# EAGLE board EEZ Arduino shield r1B12b (EAGLE 6.1), part 1 of 2
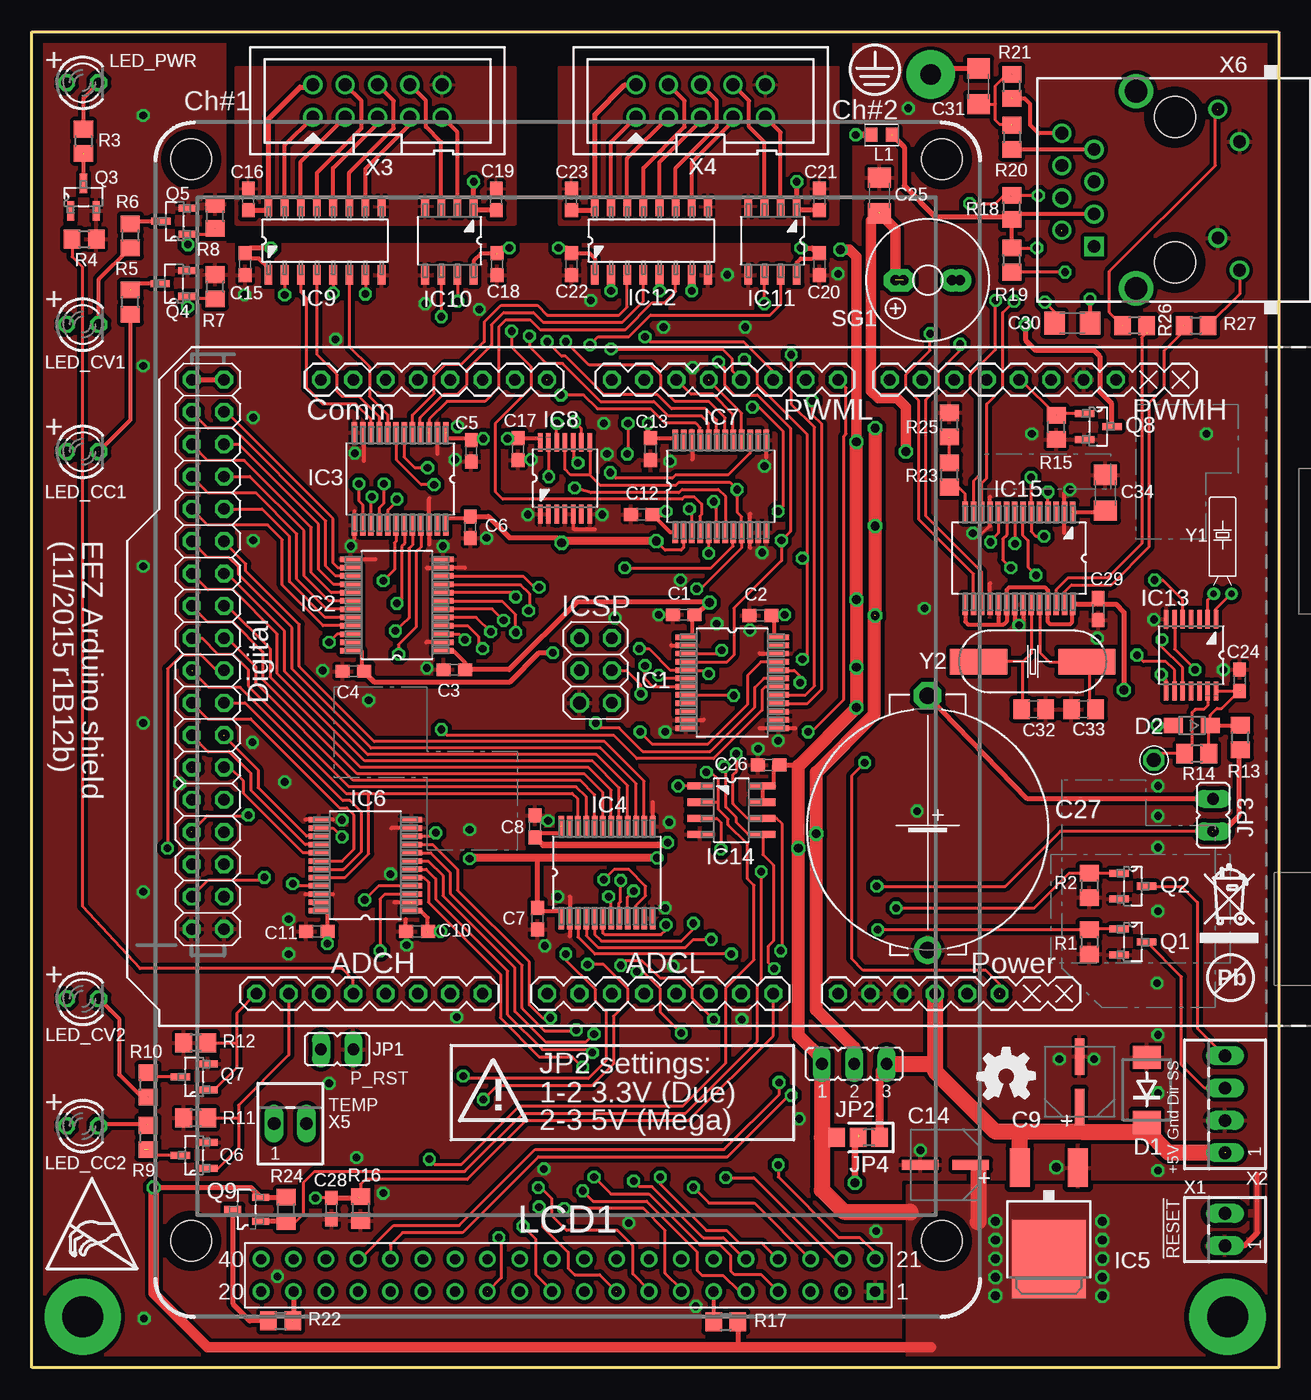
[diagram p3: board, top side]
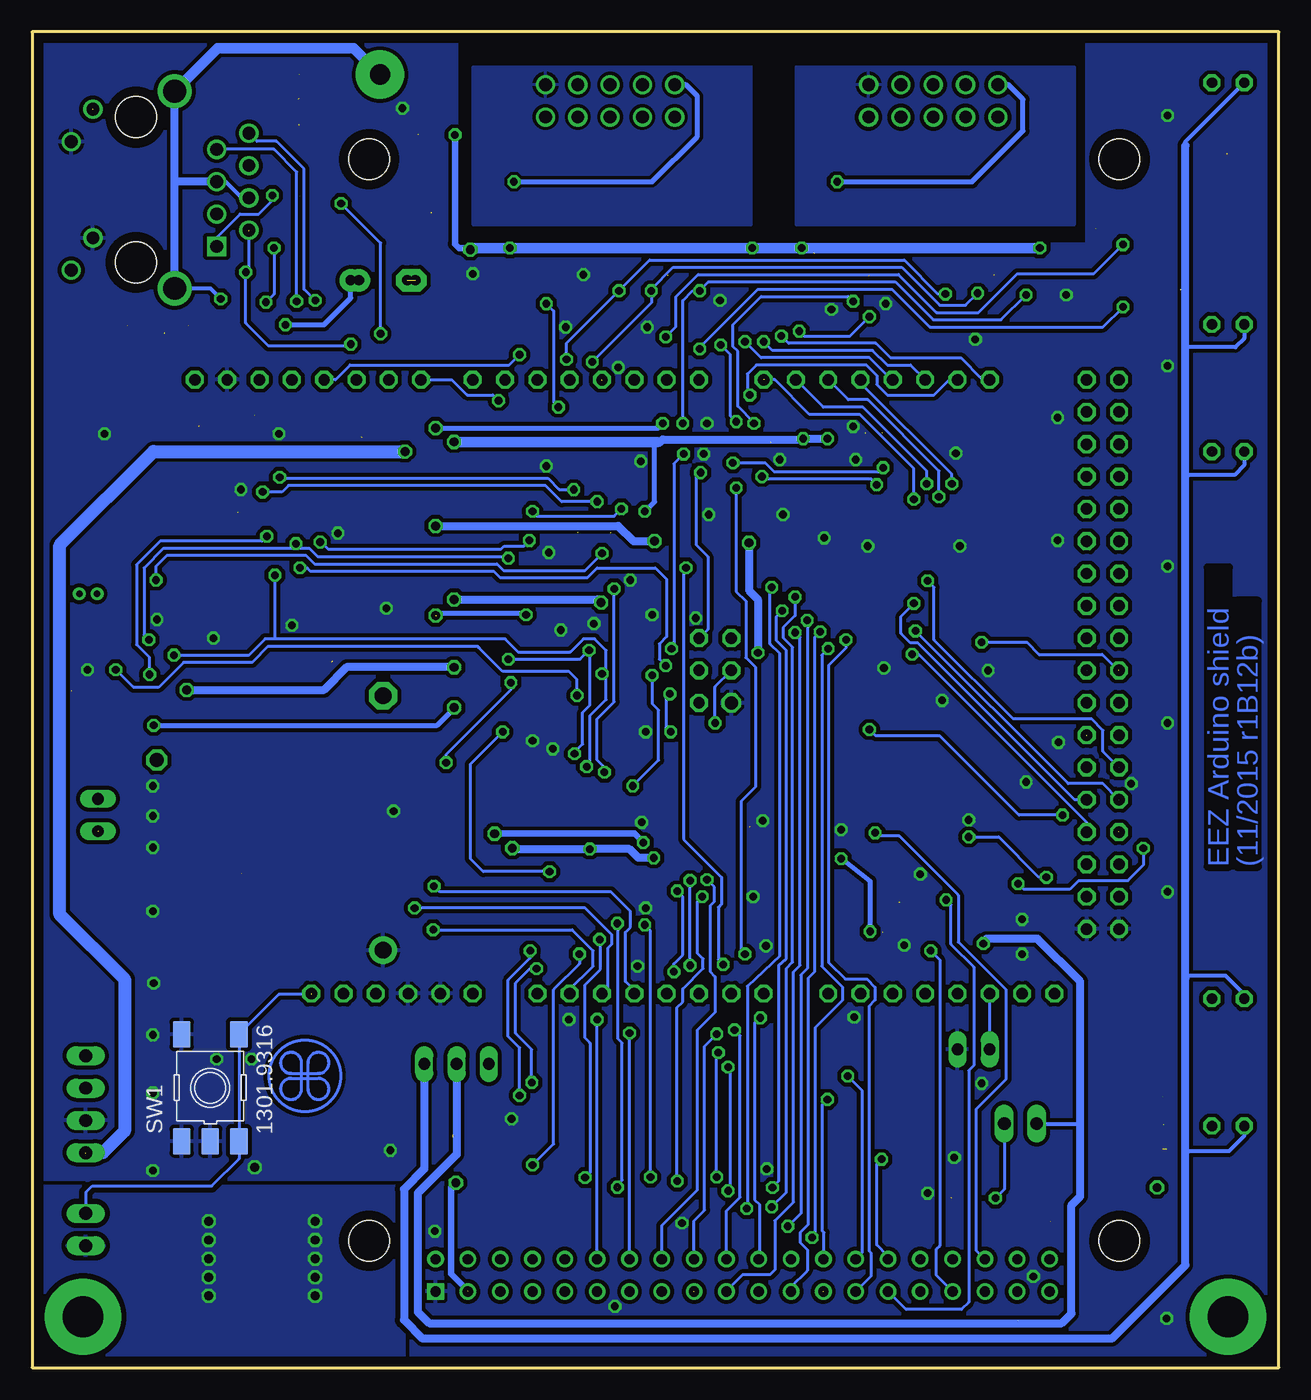
[diagram p4: board, bottom side, seen from below]

Size 98.03 x 105 mm. Coordinates in mm from the lower left corner, seen from the top.
Outline: 0,0 0,105 98,105 98,0 0,0
Copper layers (1+5*16): Top 0.035mm / dielectric 0.75mm / Route5 0.035mm / dielectric 0.75mm / Bottom 0.035mm
Design rules: minimum track width 10mil, minimum drill 0.5mm, track to track 8mil, track to pad 8mil, pad to pad 8mil, via to via 8mil, smd to smd 8mil, copper to edge 30mil, drill to drill 8mil, minimum pad ring 10mil, minimum via ring 8mil, stop-mask expansion 0mil, vias tented up to drill 25mil, thermal gap 10mil
Net classes: 0 default: width 0.254 mm, drill 0.61 mm, clearance 0.254 mm; 1 power: width 0.254 mm, drill 0.406 mm, clearance 0.203 mm; 2 gnd: width 0.254 mm, drill 0.406 mm, clearance 0.203 mm; 3 isolators: width 0.254 mm, drill 0.61 mm, clearance 0.254 mm

## Footprints (pad centres in the part's own frame; a part is rotated, then mirrored left to right if it is on the bottom)
C0603 = smd 1.1 x 1: 1 -0.85,0; 2 0.85,0
PANASONIC_C = smd 2.87 x 0.762: 1 -1.981,0; 2 1.981,0
C1206 = smd 1.6 x 1.8: 1 -1.4,0; 2 1.4,0
SG-R20MM = drill 1.3 pad 2.184 octagon: 1 10.389,0 | drill 1.3 pad 2.184: 2 -9.601,0
C0805 = smd 1.3 x 1.5: 1 -0.95,0; 2 0.95,0
DO214AA = smd 1.8 x 2.2: A 2.55,0; C -2.55,0
SOD323-W = smd 1.5 x 1.2: A 1.45,0; C -1.45,0
SOP65P780X200-24N = smd 1.651 x 0.432: 1 -3.632,3.581; 2 -3.632,2.921; 3 -3.632,2.286; 4 -3.632,1.626; 5 -3.632,0.965; 6 -3.632,0.33; 7 -3.632,-0.33; 8 -3.632,-0.965; 9 -3.632,-1.626; 10 -3.632,-2.286; 11 -3.632,-2.921; 12 -3.632,-3.581; 13 3.632,-3.581; 14 3.632,-2.921; 15 3.632,-2.286; 16 3.632,-1.626; 17 3.632,-0.965; 18 3.632,-0.33; 19 3.632,0.33; 20 3.632,0.965; 21 3.632,1.626; 22 3.632,2.286; 23 3.632,2.921; 24 3.632,3.581
DPACK = smd 1.6 x 3: 1 -2.28,-4.8; 3 2.28,-4.8 | smd 5.8 x 6.2: 4 0,2.38
SOP65P640X120-14N = smd 1.473 x 0.356: 1 -2.819,1.956; 2 -2.819,1.295; 3 -2.819,0.66; 4 -2.819,0; 5 -2.819,-0.66; 6 -2.819,-1.295; 7 -2.819,-1.956; 8 2.819,-1.956; 9 2.819,-1.295; 10 2.819,-0.66; 11 2.819,0; 12 2.819,0.66; 13 2.819,1.295; 14 2.819,1.956
SOIC-16 = smd 1.549 x 0.61: 1 -2.692,4.445; 2 -2.692,3.175; 3 -2.692,1.905; 4 -2.692,0.635; 5 -2.692,-0.635; 6 -2.692,-1.905; 7 -2.692,-3.175; 8 -2.692,-4.445; 9 2.692,-4.445; 10 2.692,-3.175; 11 2.692,-1.905; 12 2.692,-0.635; 13 2.692,0.635; 14 2.692,1.905; 15 2.692,3.175; 16 2.692,4.445
SOIC127P600X173-8N = smd 1.55 x 0.6: 1 -2.7,1.9; 2 -2.7,0.63; 3 -2.7,-0.64; 4 -2.7,-1.91; 5 2.7,-1.91; 6 2.7,-0.64; 7 2.7,0.63; 8 2.7,1.9
SOIC127P600X175-8N = smd 1.981 x 0.559: 1 -2.464,1.905; 2 -2.464,0.635; 3 -2.464,-0.635; 4 -2.464,-1.905; 5 2.464,-1.905; 6 2.464,-0.635; 7 2.464,0.635; 8 2.464,1.905
SOP65P780X200-28N = smd 1.651 x 0.432: 1 -3.632,4.216; 2 -3.632,3.581; 3 -3.632,2.921; 4 -3.632,2.286; 5 -3.632,1.626; 6 -3.632,0.965; 7 -3.632,0.33; 8 -3.632,-0.33; 9 -3.632,-0.965; 10 -3.632,-1.626; 11 -3.632,-2.286; 12 -3.632,-2.921; 13 -3.632,-3.581; 14 -3.632,-4.216; 15 3.632,-4.216; 16 3.632,-3.581; 17 3.632,-2.921; 18 3.632,-2.286; 19 3.632,-1.626; 20 3.632,-0.965; 21 3.632,-0.33; 22 3.632,0.33; 23 3.632,0.965; 24 3.632,1.626; 25 3.632,2.286; 26 3.632,2.921; 27 3.632,3.581; 28 3.632,4.216
JP1 = drill 0.914 long: 1 0,-1.27; 2 0,1.27
JUMPER_3-PIN = drill 0.914 long: 1 -2.54,0; 2 0,0; 3 2.54,0
A0R-JMP = smd 1.5 x 1.3: 1 0,1.7; 2 0,0; 3 0,-1.7
BEAD0603 = smd 1 x 1.1: P$1 -0.85,0; P$2 0.85,0
LCD_TFT_320QVT_MIRROR = drill 0.8 square: 1 48.26,0 | drill 0.8: 2 45.72,0; 3 43.18,0; 4 40.64,0; 5 38.1,0; 6 35.56,0; 7 33.02,0; 8 30.48,0; 9 27.94,0; 10 25.4,0; 11 22.86,0; 12 20.32,0; 13 17.78,0; 14 15.24,0; 15 12.7,0; 16 10.16,0; 17 7.62,0; 18 5.08,0; 19 2.54,0; 20 0,0; 21 48.26,2.54; 22 45.72,2.54; 23 43.18,2.54; 24 40.64,2.54; 25 38.1,2.54; 26 35.56,2.54; 27 33.02,2.54; 28 30.48,2.54; 29 27.94,2.54; 30 25.4,2.54; 31 22.86,2.54; 32 20.32,2.54; 33 17.78,2.54; 34 15.24,2.54; 35 12.7,2.54; 36 10.16,2.54; 37 7.62,2.54; 38 5.08,2.54; 39 2.54,2.54; 40 0,2.54 | hole 3.2: -5.5,4; 53.5,4; -5.5,89; 53.5,89
LED3MM = drill 0.813 octagon: A -1.27,0; K 1.27,0
ARDUINO+ICSP_MIRROR = drill 0.9 octagon: 0 63.5,2.54; 1 60.96,2.54; 2 58.42,2.54; 3 55.88,2.54; 3.3V 35.56,50.8; 4 53.34,2.54; 5 50.8,2.54; 5V 38.1,50.8; 5V(1) 93.98,2.54; 5V(2) 96.52,2.54; 6 48.26,2.54; 7 45.72,2.54; 8 41.656,2.54; 9 39.116,2.54; 10 36.576,2.54; 11 34.036,2.54; 12 31.496,2.54; 13 28.956,2.54; 14 68.58,2.54; 15 71.12,2.54; 16 73.66,2.54; 17 76.2,2.54; 18 78.74,2.54; 19 81.28,2.54; 20 83.82,2.54; 21 86.36,2.54; 22 93.98,5.08; 23 96.52,5.08; 24 93.98,7.62; 25 96.52,7.62; 26 93.98,10.16; 27 96.52,10.16; 28 93.98,12.7; 29 96.52,12.7; 30 93.98,15.24; 31 96.52,15.24; 32 93.98,17.78; 33 96.52,17.78; 34 93.98,20.32; 35 96.52,20.32; 36 93.98,22.86; 37 96.52,22.86; 38 93.98,25.4; 39 96.52,25.4; 40 93.98,27.94; 41 96.52,27.94; 42 93.98,30.48; 43 96.52,30.48; 44 93.98,33.02; 45 96.52,33.02; 46 93.98,35.56; 47 96.52,35.56; 48 93.98,38.1; 49 96.52,38.1; 50 93.98,40.64; 51 96.52,40.64; 52 93.98,43.18; 53 96.52,43.18; A0 50.8,50.8; A1 53.34,50.8; A2 55.88,50.8; A3 58.42,50.8; A4 60.96,50.8; A5 63.5,50.8; A6 66.04,50.8; A7 68.58,50.8; A8 73.66,50.8; A9 76.2,50.8; A10 78.74,50.8; A11 81.28,50.8; A12 83.82,50.8; A13 86.36,50.8; A14 88.9,50.8; A15 91.44,50.8; AREF 23.876,2.54; GND 26.416,2.54; GND1 40.64,50.8; GND2 43.18,50.8; GND3 93.98,45.72; GND4 96.52,45.72; ICSP_+5V 66.04,22.86; ICSP_MISO 63.5,22.86; ICSP_MOSI 66.04,25.4; ICSP_RESET 63.5,27.94; ICSP_SCK 63.5,25.4; RESET 33.02,50.8; VIN 45.72,50.8 | drill 1.016 octagon: ICSP_GND 66.04,27.94
SOT103P240X110-3N = smd 1.524 x 0.559: 1 -1.079,1.016; 2 -1.079,-1.016; 3 1.079,0
SOT95P237X112-3N = smd 1.321 x 0.559: 1 -1.092,0.94; 2 -1.092,-0.94; 3 1.092,0
R0805 = smd 1.3 x 1.5: 1 -0.95,0; 2 0.95,0
BUZZER = drill 0.8 pad 1.778 octagon: + 1.905,0; +B 2.54,0 | drill 0.8 pad 1.778: - -1.905,0; -B -2.54,0
TACTM-6XN = smd 2.1 x 1.4: 1 -4.2,2.25; 2 4.2,2.25; 3 -4.2,-2.25; 4 4.2,-2.25; 5 -4.2,0
PCB_SHIELD_TAB = drill 1.1 octagon: 1 0,0
22-23-2021 = drill 1 long: 1 -1.27,0; 2 1.27,0
22-23-2041 = drill 1 long: 1 -3.81,0; 2 -1.27,0; 3 1.27,0; 4 3.81,0
IDC-10PIN = drill 1 pad 1.422: 1 -5.08,-1.27; 2 -5.08,1.27; 3 -2.54,-1.27; 4 -2.54,1.27; 5 0,-1.27; 6 0,1.27; 7 2.54,-1.27; 8 2.54,1.27; 9 5.08,-1.27; 10 5.08,1.27
RJ45-TRAFO-LED = drill 1 square: 1 -4.445,6.35 | drill 1: 2 -3.175,8.89; 3 -1.905,6.35; 4 -0.635,8.89; 5 0.635,6.35; 6 1.905,8.89; 7 3.175,6.35; 8 4.445,8.89; 9 -6.325,-5.08; 10 -3.785,-3.38; 11 3.785,-5.08; 12 6.325,-3.38 | drill 1.8: SH1 -7.75,3.05; SH2 7.75,3.05 | hole 3.251: -5.715,0; 5.715,0
R26_XTAL = drill 0.5: 1 -0.7,0; 2 0.7,0
HC-49/4H = smd 4.5 x 2: 1 -4.25,0; 2 4.25,0

## Placement (x,y rotation side)
C1  100n  [C0603]  51.24,59.18 180 top
C2  100n  [C0603]  57.27,59.12 0 top
C3  100n  [C0603]  33.21,54.86 180 top
C4  100n  [C0603]  25.27,54.74 0 top
C5  100n  [C0603]  34.54,72.06 270 top
C6  100n  [C0603]  34.48,66.05 90 top
C7  100n  [C0603]  39.75,35.31 270 top
C8  100n  [C0603]  39.56,42.55 270 top
C9  47u  [PANASONIC_C]  82.36,22.48 90 top
C10  100n  [C0603]  30.29,34.29 180 top
C11  100n  [C0603]  22.41,34.29 0 top
C12  100n  [C0603]  47.94,67.06 180 top
C13  100n  [C0603]  48.64,72.2 90 top
C14  10u  [PANASONIC_C]  71.82,15.94 180 top
C15  100n  [C0603]  16.76,86.74 270 top
C16  100n  [C0603]  17.02,91.82 90 top
C17  100n  [C0603]  38.22,72.2 90 top
C18  100n  [C0603]  36.57,86.74 270 top
C19  100n  [C0603]  36.51,91.82 90 top
C20  100n  [C0603]  61.91,86.74 270 top
C21  100n  [C0603]  61.91,91.82 90 top
C22  100n  [C0603]  42.41,86.74 270 top
C23  100n  [C0603]  42.41,91.82 90 top
C24  100n  [C0603]  94.93,54.04 270 top
C25  10u  [C1206]  66.61,92.14 270 top
C26  100n  [C0603]  57.91,47.37 180 top
C27  EECS5R5H105  [SG-R20MM]  70.42,42.42 90 top
C28  100n  [C0603]  23.56,12.51 90 top
C29  100n  [C0603]  83.82,59.63 270 top
C30  10n  [C1206]  81.78,82.11 0 top
C31  10n  [C1206]  74.42,100.71 90 top
C32  18p  [C0805]  78.74,51.75 0 top
C33  18p  [C0805]  82.67,51.75 180 top
C34  10u  [C1206]  84.39,68.77 270 top
D1  SMBJ5.0A-TR  [DO214AA]  87.63,21.84 90 top
D2  BAS316  [SOD323-W]  91.18,50.48 180 top
EEZ_SIGNATURE  SIGNATURESMALL  [SIGNATURE_5MM]  76.57,22.93 180 top
IC1  SN74LVCC3245ADBRSSOP  [SOP65P780X200-24N]  55.05,53.85 0 top
IC2  SN74LVCC3245ADBRSSOP  [SOP65P780X200-24N]  28.7,59.94 180 top
IC3  SN74LVCC3245ADBRSSOP  [SOP65P780X200-24N]  28.95,69.85 270 top
IC4  SN74LVCC3245ADBRSSOP  [SOP65P780X200-24N]  45.21,38.93 90 top
IC5  LD1117ADT33TR  [DPACK]  79.94,10.92 180 top
IC6  SN74LVCC3245ADBRSSOP  [SOP65P780X200-24N]  26.22,39.5 180 top
IC7  SN74LVCC3245ADBRSSOP  [SOP65P780X200-24N]  54.16,69.28 90 top
IC8  SN74LV125APW  [SOP65P640X120-14N]  41.91,69.91 90 top
IC9  Si8660EC-B-IS1  [SOIC-16]  23.05,88.58 90 top
IC10  SI8620EC-B-IS  [SOIC127P600X173-8N]  32.83,88.58 270 top
IC11  SI8620EC-B-IS  [SOIC127P600X173-8N]  58.23,88.58 270 top
IC12  Si8660EC-B-IS1  [SOIC-16]  48.7,88.58 90 top
IC13  PCA21125  [SOP65P640X120-14N]  91.12,56.01 270 top
IC14  AT25256B  [SOIC127P600X175-8N]  54.99,43.81 0 top
IC15  ENC28J60-I/SS  [SOP65P780X200-28N]  77.59,63.63 270 top
JP1  826926-2  [JP1]  24,25.02 270 top
JP2  826926-3  [JUMPER_3-PIN]  64.64,23.88 0 top
JP3  826926-2  [JP1]  92.83,43.43 0 top
JP4  0R-JUMPA  [A0R-JMP]  64.96,18.1 270 top
L1  60R@100MHz  [BEAD0603]  66.8,96.9 180 top
LCD1  TFT_320QVT  [LCD_TFT_320QVT_MIRROR]  18.03,5.99 0 top
LED_CC1  L-934ID  [LED3MM]  4,72 0 top
LED_CC2  L-934ID  [LED3MM]  4,19 0 top
LED_CV1  L-934YD  [LED3MM]  4,82 0 top
LED_CV2  L-934YD  [LED3MM]  4,29 0 top
LED_PWR  L-934MBC  [LED3MM]  4,101 0 top
MCU  [ARDUINO+ICSP_MIRROR]  109.09,80.2 180 top
Q1  2N7002  [SOT103P240X110-3N]  86.55,33.46 0 top
Q2  2N7002  [SOT103P240X110-3N]  86.55,37.85 0 top
Q3  2N7002  [SOT103P240X110-3N]  4.06,92.01 90 top
Q4  2N7002  [SOT103P240X110-3N]  11.17,85.22 180 top
Q5  2N7002  [SOT103P240X110-3N]  11.24,90.11 180 top
Q6  2N7002  [SOT103P240X110-3N]  12.76,16.7 180 top
Q7  2N7002  [SOT103P240X110-3N]  12.76,22.86 180 top
Q8  2N7002  [SOT103P240X110-3N]  83.82,73.98 0 top
Q9  IRLML2246TRPBF  [SOT95P237X112-3N]  16.89,12.45 180 top
R1  100K  [R0805]  83.12,33.46 270 top
R2  100K  [R0805]  83.12,37.91 270 top
R3  240R  [R0805]  4.06,96.39 270 top
R4  100K  [R0805]  4.12,88.71 0 top
R5  240R  [R0805]  7.74,83.76 90 top
R6  240R  [R0805]  7.74,88.96 270 top
R7  100K  [R0805]  14.41,84.96 90 top
R8  100K  [R0805]  14.41,90.49 90 top
R9  240R  [R0805]  9.14,18.1 270 top
R10  240R  [R0805]  9.14,22.23 270 top
R11  100K  [R0805]  12.89,19.62 180 top
R12  100K  [R0805]  12.89,25.53 180 top
R13  560R  [R0805]  94.99,49.53 90 top
R14  10K  [R0805]  91.56,48.26 180 top
R15  100K  [R0805]  80.51,73.91 90 top
R16  4K7  [R0805]  25.84,12.51 270 top
R17  10K  [R0805]  54.54,3.62 0 top
R18  50R 0.1%  [R0805]  77.02,91.19 90 top
R19  50R 0.1%  [R0805]  77.02,87.06 90 top
R20  50R 0.1%  [R0805]  77.02,96.71 270 top
R21  50R 0.1%  [R0805]  77.02,100.71 90 top
R22  10R  [R0805]  19.56,3.68 0 top
R23  2K2 1%  [R0805]  72.13,70.17 90 top
R24  100K  [R0805]  20,12.45 90 top
R25  120R 1%  [R0805]  72.13,74.1 90 top
R26  200R  [R0805]  86.67,81.92 180 top
R27  200R  [R0805]  91.5,81.92 0 top
SG1  LD-BZEN-0903  [BUZZER]  70.42,85.47 180 top
SW1  1301.9316  [TACTM-6XN]  84,22 90 bottom
TP1  [PCB_SHIELD_TAB]  88.2,47.75 0 top
U$2  [RECYCLE_BIN1/8]  91.82,33.4 0 top
U$3  [PB_SMALL]  94.24,30.67 0 top
U$4  [ESD_SYMBOL]  1.17,7.79 0 top
X1  22-23-2021  [22-23-2021]  93.79,10.86 90 top
X2  22-23-2041  [22-23-2041]  93.78,20.7 90 top
X3  09185106324  [IDC-10PIN]  27.18,99.57 0 top
X4  09185106324  [IDC-10PIN]  52.57,99.57 0 top
X5  22-23-2021  [22-23-2021]  20.32,19.18 0 top
X6  LMJTAB881243M-L  [RJ45-TRAFO-LED]  89.85,92.58 90 top
Y1  32,768kHz  [R26_XTAL]  93.6,60.83 0 top
Y2  25MHz  [HC-49/4H]  78.67,55.5 180 top